# EAGLE design Nick Lester Final (EAGLE 9.2.2)
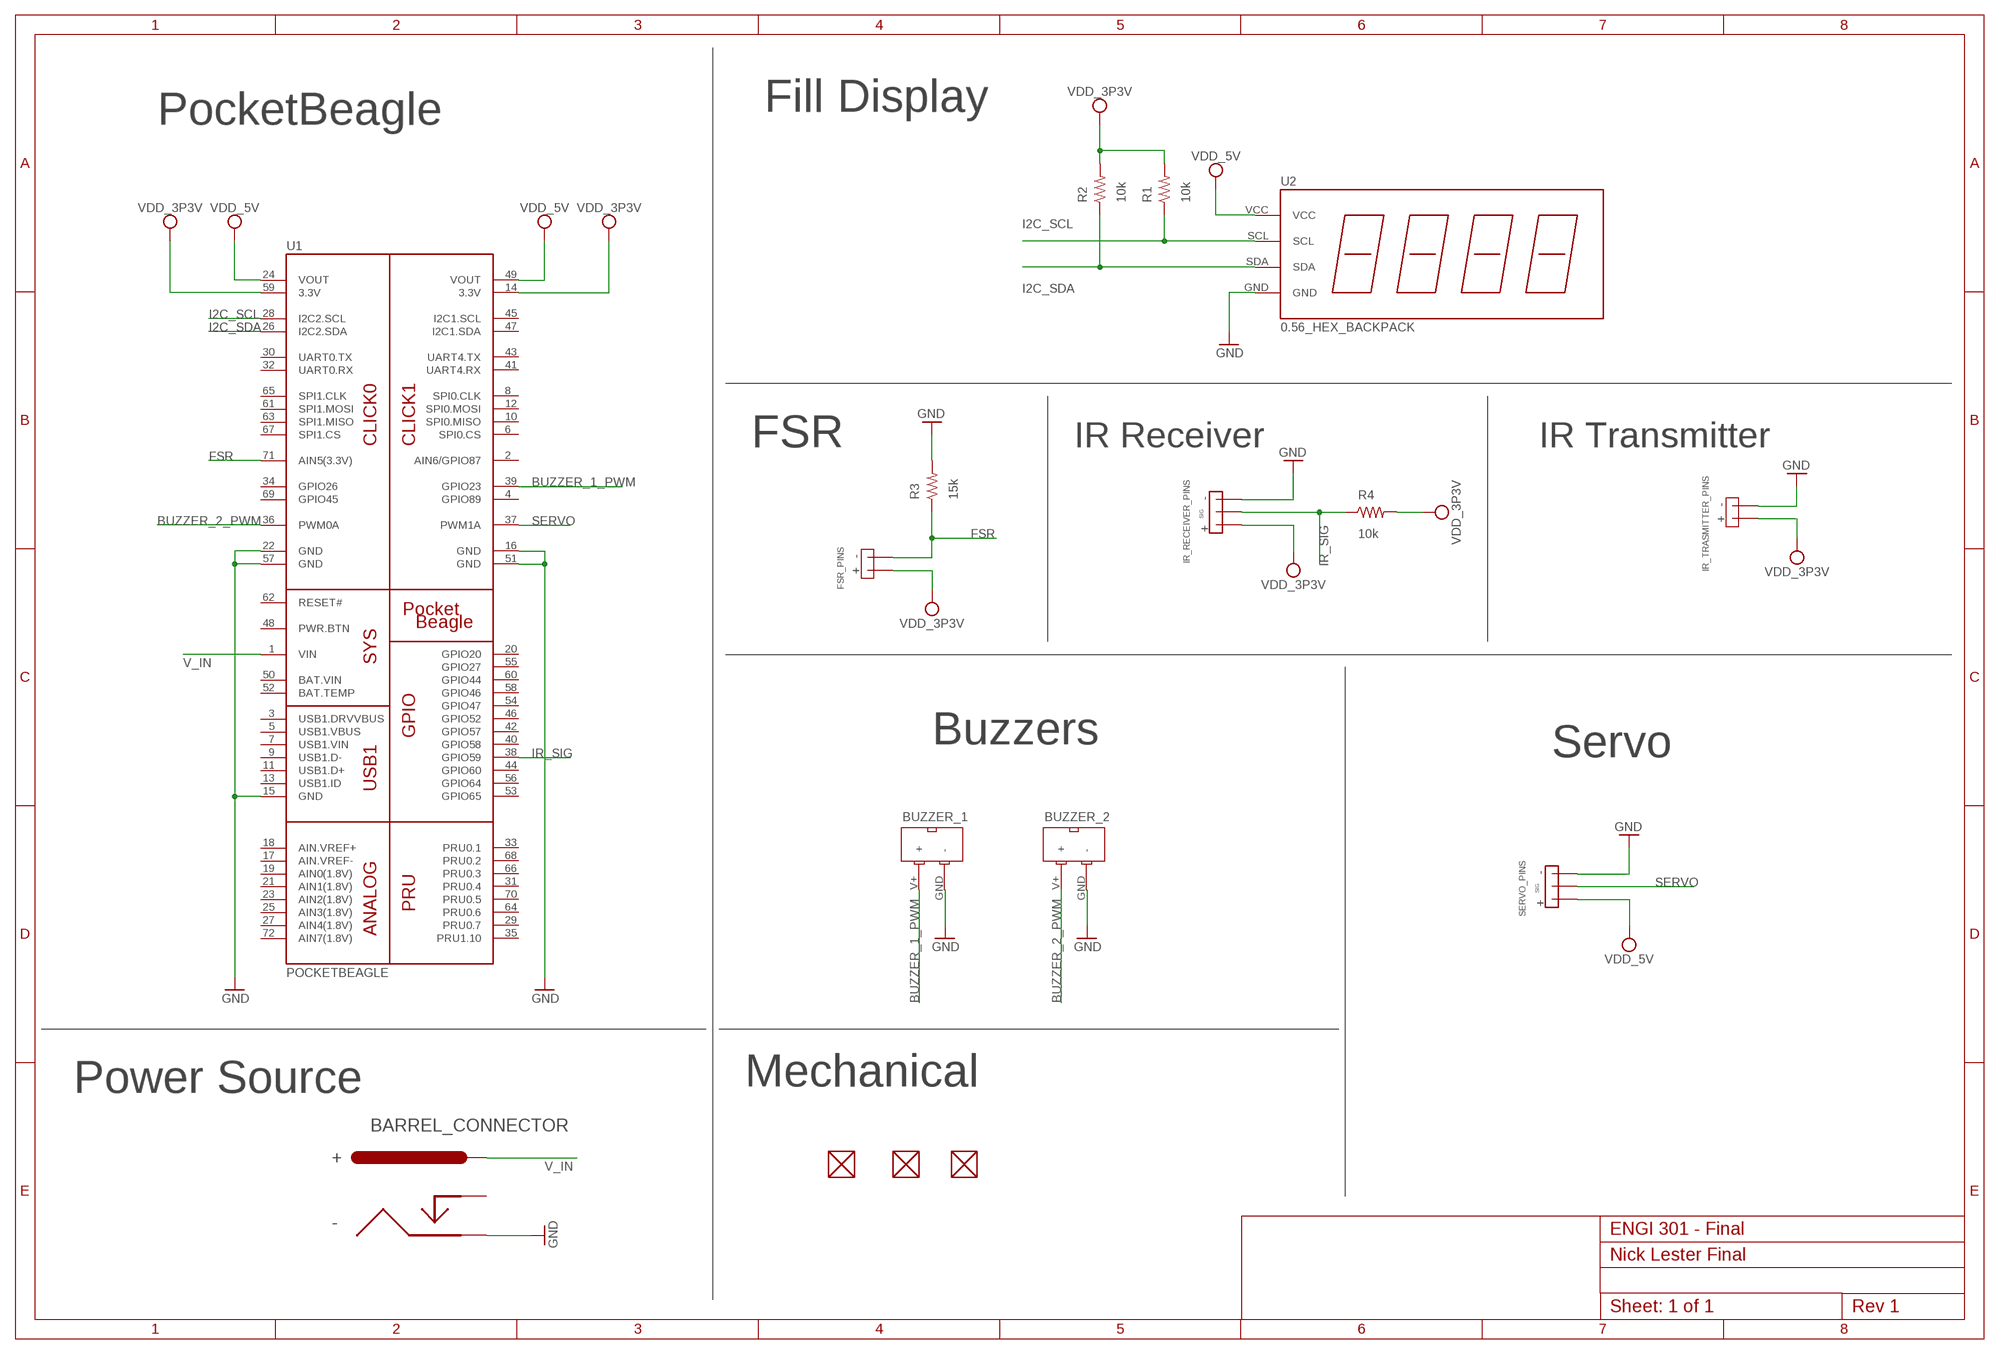
[diagram p0: schematic, sheet 1]

## Parts
BARREL_CONNECTOR  BARREL_CONNECTOR  [BARREL_CONNECTOR]
BUZZER_1  PS1240_BUZZER  [PS1240_BUZZER]
BUZZER_2  PS1240_BUZZER  [PS1240_BUZZER]
FSR_PINS  2_PIN_HEADER  [2_PIN_HEADER]
FUD1  FIDUCIAL  [FIDUCIAL_40MIL]
FUD2  FIDUCIAL  [FIDUCIAL_40MIL]
FUD3  FIDUCIAL  [FIDUCIAL_40MIL]
IR_RECEIVER_PINS  3_PIN_HEADER  [3_PIN_HEADER]
IR_TRASMITTER_PINS  2_PIN_HEADER  [2_PIN_HEADER]
R1  10k  R_R0603  [R0603]
R2  10k  R_R0603  [R0603]
R3  15k  R_R0603  [R0603]
R4  10k  R_R0603  [R0603]
SERVO_PINS  3_PIN_HEADER  [3_PIN_HEADER]
U1  POCKETBEAGLE  [POCKETBEAGLE]
U2  0.56_HEX_BACKPACK  [0.56_HEX_BACKPACK]

## Nets
BUZZER_1_PWM: BUZZER_1.V+(+) U1.39(GPIO23)
BUZZER_2_PWM: BUZZER_2.V+(+) U1.36(PWM0A)
FSR: FSR_PINS.GND R3.1 U1.71(AIN5(3.3V))
GND: BARREL_CONNECTOR.GND BUZZER_1.GND(-) BUZZER_2.GND(-) IR_RECEIVER_PINS.GND IR_TRASMITTER_PINS.GND R3.2 SERVO_PINS.GND U1.15(GND) U1.16(GND) U1.22(GND) U1.51(GND) U1.57(GND) U2.GND
I2C_SCL: R1.1 U1.28(I2C2.SCL) U2.SCL
I2C_SDA: R2.1 U1.26(I2C2.SDA) U2.SDA
IR_SIG: IR_RECEIVER_PINS.SIG R4.1 U1.38(GPIO59)
SERVO: SERVO_PINS.SIG U1.37(PWM1A)
V_IN: BARREL_CONNECTOR.V+ U1.1(VIN)
VDD_3P3V: FSR_PINS.V+ IR_RECEIVER_PINS.V+ IR_TRASMITTER_PINS.V+ R1.2 R2.2 R4.2 U1.14(3.3V) U1.59(3.3V)
VDD_5V: SERVO_PINS.V+ U1.24(VOUT) U1.49(VOUT) U2.VCC
Unconnected: BARREL_CONNECTOR.NC FUD1.P$1 FUD2.P$1 FUD3.P$1 U1.2(AIN6/GPIO87) U1.3(USB1.DRVVBUS) U1.4(GPIO89) U1.5(USB1.VBUS) U1.6(SPI0.CS) U1.7(USB1.VIN) U1.8(SPI0.CLK) U1.9(USB1.D-) U1.10(SPI0.MISO) U1.11(USB1.D+) U1.12(SPI0.MOSI) U1.13(USB1.ID) U1.17(AIN.VREF-) U1.18(AIN.VREF+) U1.19(AIN0(1.8V)) U1.20(GPIO20) U1.21(AIN1(1.8V)) U1.23(AIN2(1.8V)) U1.25(AIN3(1.8V)) U1.27(AIN4(1.8V)) U1.29(PRU0.7) U1.30(UART0.TX) U1.31(PRU0.4) U1.32(UART0.RX) U1.33(PRU0.1) U1.34(GPIO26) U1.35(PRU1.10) U1.40(GPIO58) U1.41(UART4.RX) U1.42(GPIO57) U1.43(UART4.TX) U1.44(GPIO60) U1.45(I2C1.SCL) U1.46(GPIO52) U1.47(I2C1.SDA) U1.48(PWR.BTN) U1.52(BAT.TEMP) U1.53(GPIO65) U1.54(GPIO47) U1.55(GPIO27) U1.56(GPIO64) U1.58(GPIO46) U1.60(GPIO44) U1.61(SPI1.MOSI) U1.62(RESET#) U1.63(SPI1.MISO) U1.64(PRU0.6) U1.65(SPI1.CLK) U1.66(PRU0.3) U1.67(SPI1.CS) U1.68(PRU0.2) U1.69(GPIO45) U1.70(PRU0.5) U1.72(AIN7(1.8V))

## Notes on the sheet
- PocketBeagle | Fill Display
- FSR | IR Receiver | IR Transmitter
- Buzzers | Servo
- Power Source | Mechanical
- ENGI 301 - Final
- 1 of 1

## Power pins joined to a net without a drawn wire
BAT.VIN: U1.50(BAT.VIN)

## Library data of the parts
BARREL_CONNECTOR = Nick Lester Final:BARREL_CONNECTOR: Barrel Connector: https://www.adafruit.com/product/373
BUZZER_1 BUZZER_2 = Nick Lester Final:PS1240_BUZZER: PS1240 Buzzer: https://www.adafruit.com/product/160?gclid=Cj0KCQiAi57gBRDqARIsABhDSMod10IM6KqyKNG4e1XYbRL67-mP7OMwaXZ0MBZD_4btt3ozxb4l5BUaAtnaEALw_wcB
FSR_PINS IR_TRASMITTER_PINS = Nick Lester Final:2_PIN_HEADER: 2 Pin Header: https://media.digikey.com/pdf/Data%20Sheets/Sullins%20PDFs/Female_Headers.100_DS.pdf
FUD1-FUD3 = ENGI301:FIDUCIAL
IR_RECEIVER_PINS SERVO_PINS = Nick Lester Final:3_PIN_HEADER: 3 Pin Header: https://media.digikey.com/pdf/Data%20Sheets/Sullins%20PDFs/Female_Headers.100_DS.pdf
R1-R4 = ENGI301:R_: RESISTOR, American symbol
U1 = ENGI301:POCKETBEAGLE
U2 = ENGI301:0.56_HEX_BACKPACK: 0.56" LED HEX Backback - Adafruit HT16K33 - https://www.adafruit.com/product/878 - https://www.adafruit.com/product/879 - https://www.adafruit.com/product/880 - https://www.adafruit.com/product/881 - https://www.adafruit.com/product/1002

## Board
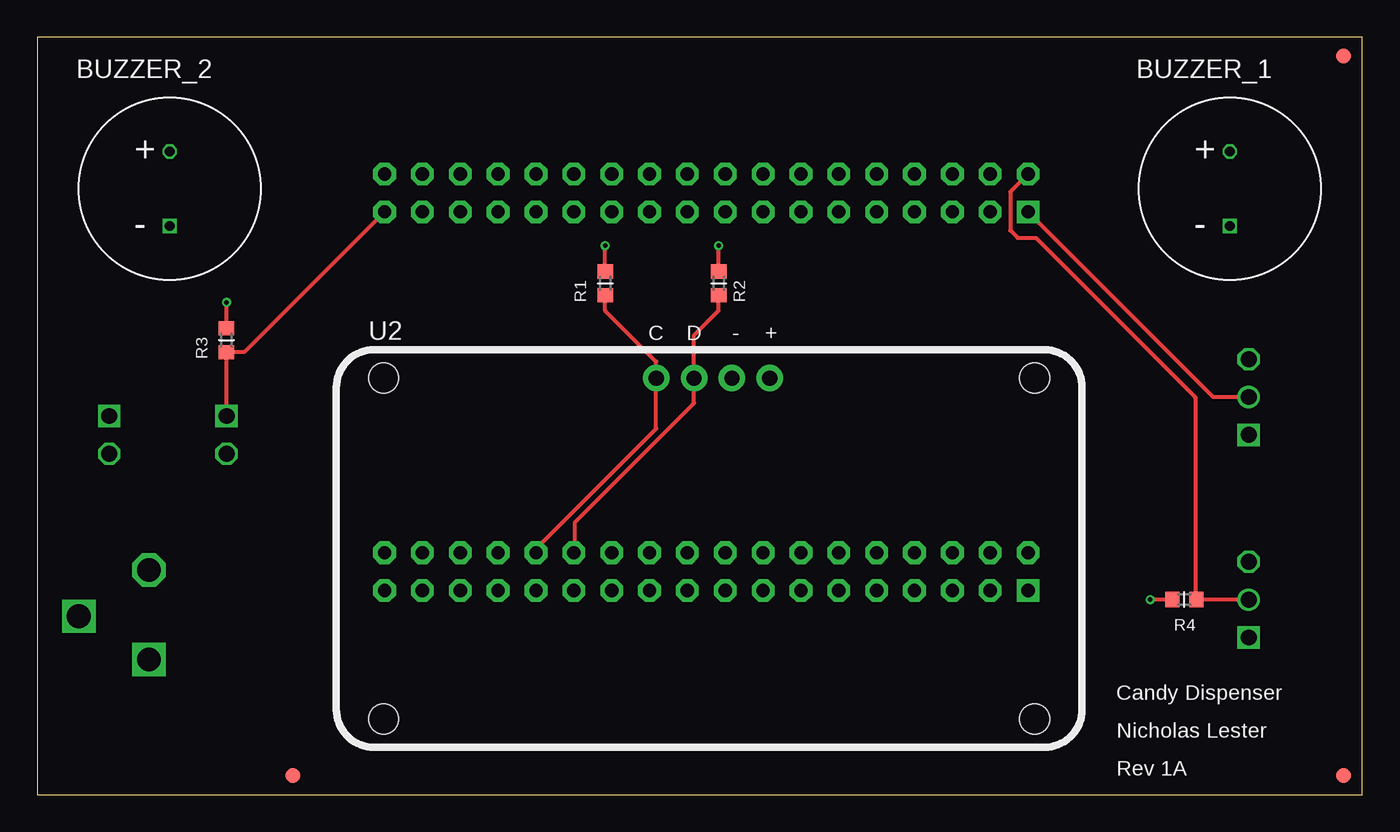
[diagram p1: board, top side]
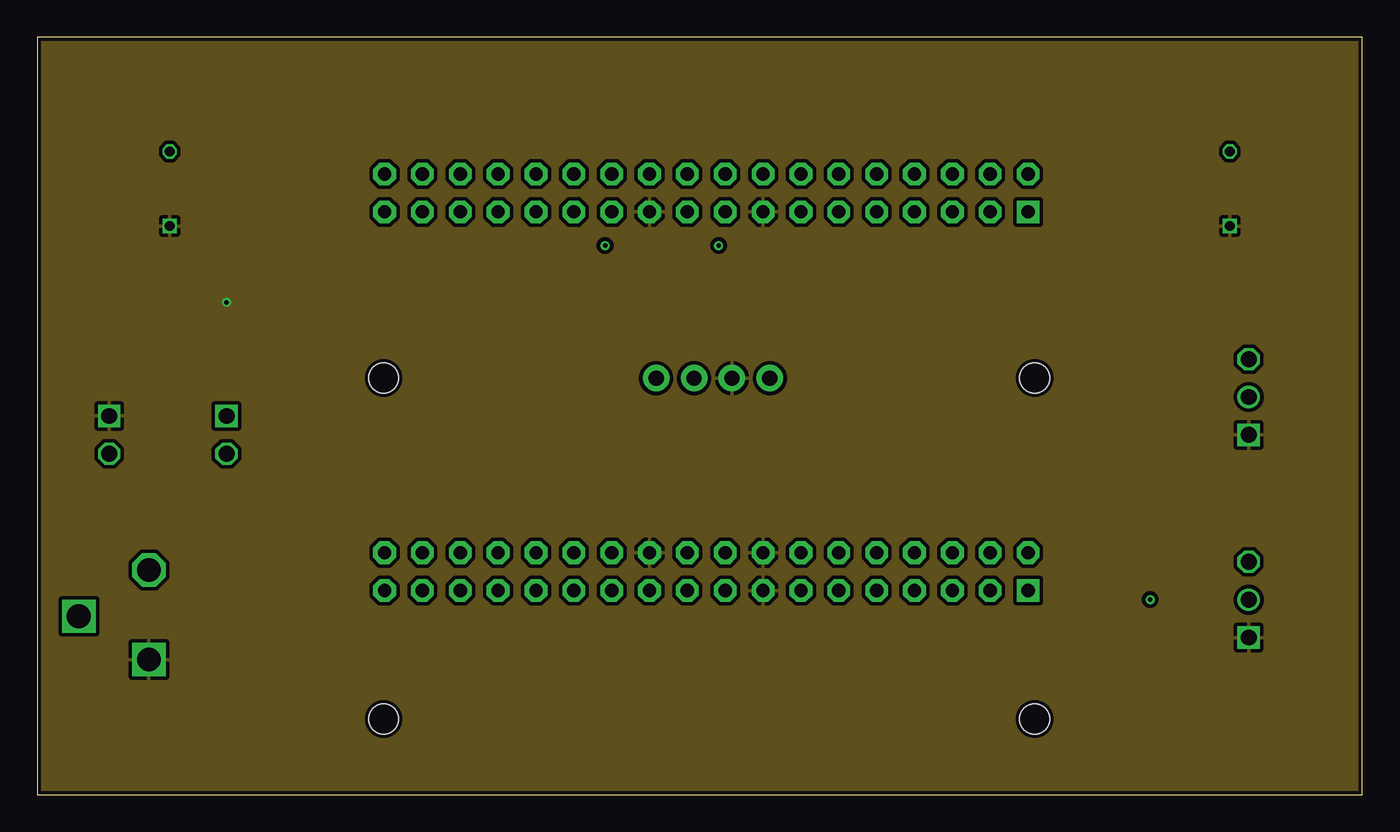
[diagram p2: board, inner layer Route2]
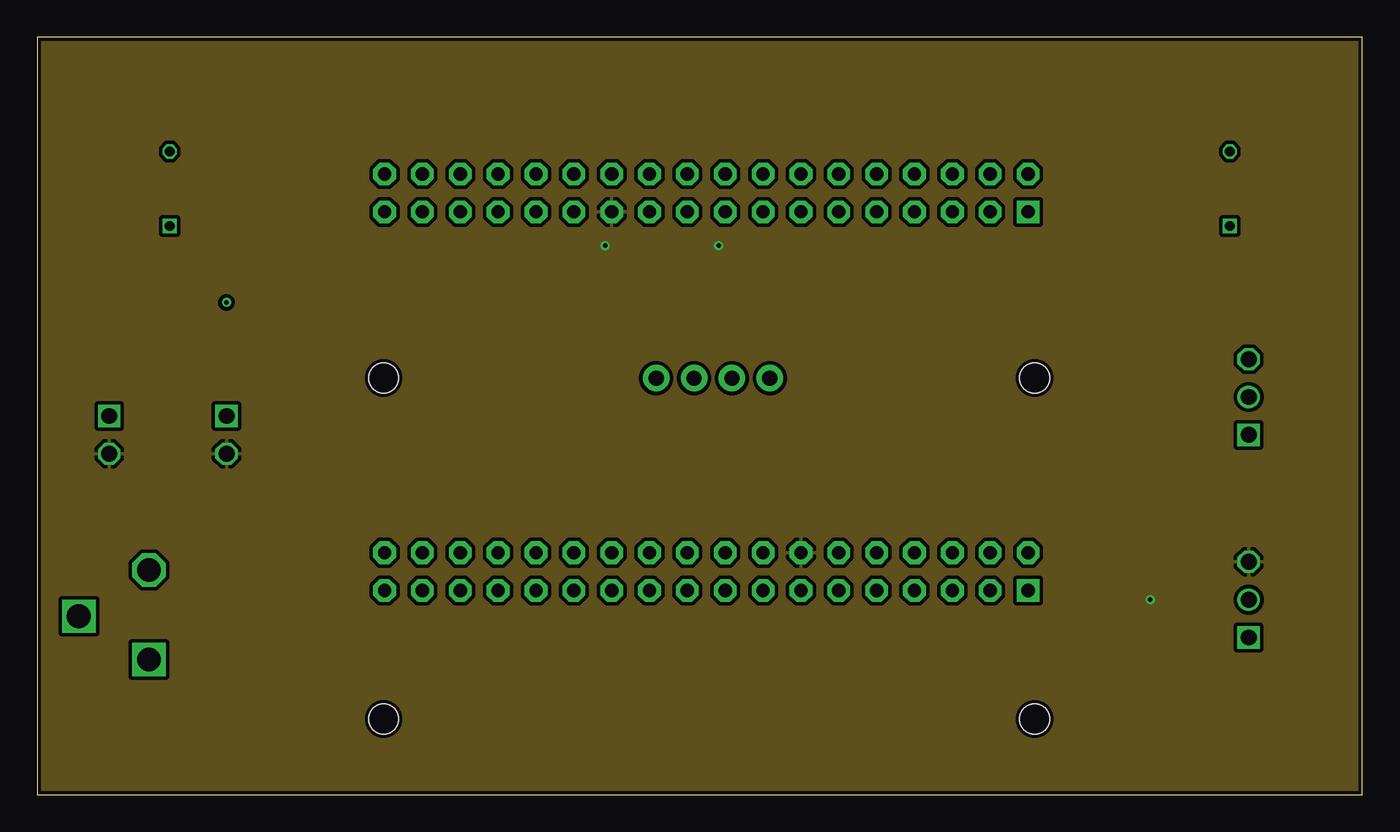
[diagram p3: board, inner layer Route15]
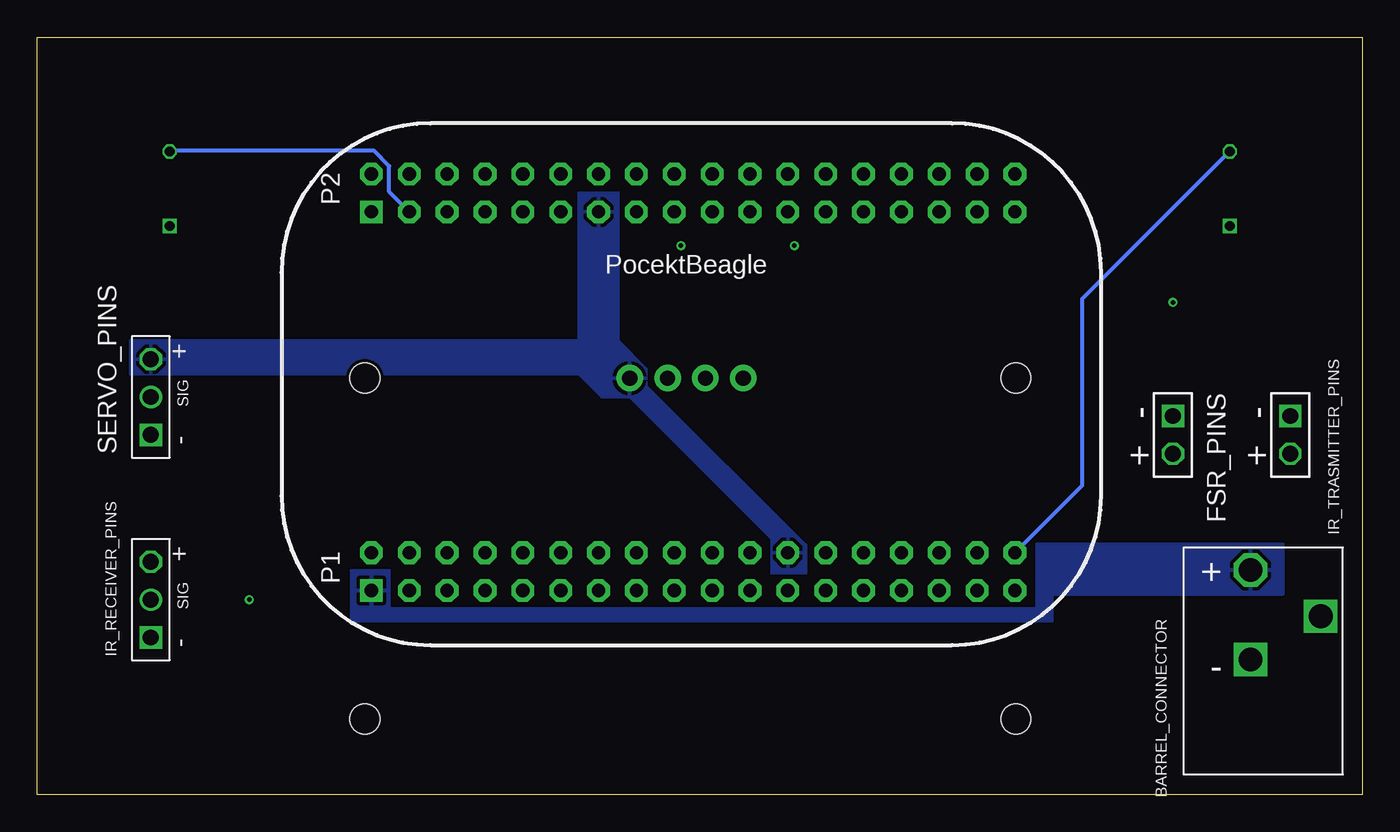
[diagram p4: board, bottom side, seen from below]

Size 88.9 x 50.8 mm. Coordinates in mm from the lower left corner, seen from the top.
Outline: 0,0 88.9,0 88.9,50.8 0,50.8 0,0
Copper layers (1*2*15*16): Top 0.035mm / dielectric 0.23mm / Route2 0.035mm / dielectric 0.93mm / Route15 0.035mm / dielectric 0.23mm / Bottom 0.035mm
Design rules "ENGI301_4lyr": minimum track width 10mil, minimum drill 12mil, track to track 10mil, track to pad 10mil, pad to pad 10mil, via to via 10mil, smd to smd 10mil, copper to edge 10mil, drill to drill 12mil, minimum pad ring 6mil, minimum via ring 6mil, stop-mask expansion 3mil, vias tented up to drill 25mil, thermal gap 10mil

### Footprints (pad centres in the part's own frame; a part is rotated, then mirrored left to right if it is on the bottom)
BARREL_CONNECTOR = drill 1.6 square: GND 0,3; NC -4.7,0.1 | drill 1.6 octagon: V+ 0,-3
PS1240_BUZZER = drill 0.65 square: GND 0,-2.5 | drill 0.65 octagon: V+ 0,2.5
2_PIN_HEADER = drill 1.067 square: GND -1.27,0 | drill 1.067 octagon: V+ 1.27,0
FIDUCIAL_40MIL = smd 1.016 x 1.016: P$1 0,0
3_PIN_HEADER = drill 1.067 square: GND -2.54,0 | drill 1.067: SIG 0,0 | drill 1.067 octagon: V+ 2.54,0
R0603 = smd 0.95 x 1.031: 1 -0.8,0; 2 0.8,0
POCKETBEAGLE = drill 0.889 pad 1.524 square: 1 5.91,3.53; 37 5.91,28.93 | drill 0.889 pad 1.524 octagon: 2 5.91,6.07; 3 8.45,3.53; 4 8.45,6.07; 5 10.99,3.53; 6 10.99,6.07; 7 13.53,3.53; 8 13.53,6.07; 9 16.07,3.53; 10 16.07,6.07; 11 18.61,3.53; 12 18.61,6.07; 13 21.15,3.53; 14 21.15,6.07; 15 23.69,3.53; 16 23.69,6.07; 17 26.23,3.53; 18 26.23,6.07; 19 28.77,3.53; 20 28.77,6.07; 21 31.31,3.53; 22 31.31,6.07; 23 33.85,3.53; 24 33.85,6.07; 25 36.39,3.53; 26 36.39,6.07; 27 38.93,3.53; 28 38.93,6.07; 29 41.47,3.53; 30 41.47,6.07; 31 44.01,3.53; 32 44.01,6.07; 33 46.55,3.53; 34 46.55,6.07; 35 49.09,3.53; 36 49.09,6.07; 38 5.91,31.47; 39 8.45,28.93; 40 8.45,31.47; 41 10.99,28.93; 42 10.99,31.47; 43 13.53,28.93; 44 13.53,31.47; 45 16.07,28.93; 46 16.07,31.47; 47 18.61,28.93; 48 18.61,31.47; 49 21.15,28.93; 50 21.15,31.47; 51 23.69,28.93; 52 23.69,31.47; 53 26.23,28.93; 54 26.23,31.47; 55 28.77,28.93; 56 28.77,31.47; 57 31.31,28.93; 58 31.31,31.47; 59 33.85,28.93; 60 33.85,31.47; 61 36.39,28.93; 62 36.39,31.47; 63 38.93,28.93; 64 38.93,31.47; 65 41.47,28.93; 66 41.47,31.47; 67 44.01,28.93; 68 44.01,31.47; 69 46.55,28.93; 70 46.55,31.47; 71 49.09,28.93; 72 49.09,31.47
0.56_HEX_BACKPACK = drill 1.016 pad 1.778: GND 1.524,11.43; SCL -3.556,11.43; SDA -1.016,11.43; VCC 4.064,11.43 | hole 2: -21.844,-11.43; 21.844,-11.43; -21.844,11.43; 21.844,11.43

### Placement (x,y rotation side)
BARREL_CONNECTOR  7.49,12.06 180 bottom
BUZZER_1  80.01,40.64 0 top
BUZZER_2  8.89,40.64 0 top
FSR_PINS  12.7,24.13 270 bottom
FUD1  87.63,49.53 0 top
FUD2  17.14,1.27 0 top
FUD3  87.63,1.27 0 top
IR_RECEIVER_PINS  81.28,13.08 90 bottom
IR_TRASMITTER_PINS  4.83,24.13 270 bottom
R1  38.1,34.29 90 top
R2  45.72,34.29 90 top
R3  12.7,30.48 90 top
R4  76.96,13.08 180 top
SERVO_PINS  81.28,26.67 90 bottom
U1  72.39,10.16 0 bottom
U2  45.09,16.51 0 top

### Tracks (layer width: path | path; a pad name or v marks a point on that pad's centre or on a via)
BUZZER_1_PWM
  Bottom 0.254: U1.39 65.28,40.43 65.28,42.16 66.29,43.18 79.97,43.18 BUZZER_1.V+
BUZZER_2_PWM
  Bottom 0.254: BUZZER_2.V+ 18.8,33.23 18.8,20.73 U1.36
FSR
  Top 0.254: U1.71 13.93,29.72 12.74,29.72 R3.1 FSR_PINS.GND
GND  (via drill 0.3 pad 0.61)
  Top 0.254: R3.2 v12.7,33.02
  pour Route2: -1.27,-1.27 90.17,-1.27 90.17,52.07 -1.27,52.07
I2C_SCL
  Top 0.254: U1.28 33.46,16.48 41.53,24.55 U2.SCL 41.53,29.05 38.1,32.47 R1.1
I2C_SDA
  Top 0.254: U1.26 36.07,16.3 36.07,18.26 44.07,26.26 U2.SDA 44.07,30.82 45.72,32.47 R2.1
IR_SIG
  Top 0.254: U1.38 65.28,40.43 65.28,37.85 65.79,37.34 67.01,37.34 77.7,26.64 77.7,13.14 R4.1 IR_RECEIVER_PINS.SIG
SERVO
  Top 0.254: U1.37 78.9,26.67 SERVO_PINS.SIG
V_IN
  pour Bottom: 5.33,13.46 5.33,16.76 21.84,16.76 21.84,12.45 65.28,12.45 65.28,14.99 67.82,14.99 67.82,11.68 20.83,11.68 20.83,13.46
VDD_3P3V  (via drill 0.3 pad 0.61)
  Top 0.254: R1.2 v38.1,36.83 | R2.2 v45.72,36.83 | R4.2 v74.68,13.08
  pour Route15: -2.54,-2.54 91.44,-2.54 91.44,53.34 -2.54,53.34
VDD_5V
  pour Bottom: 49.91,40.39 49.91,30.48 48.01,28.57 48.01,27.43 37.34,16.76 37.34,14.86 39.62,14.86 39.62,17.14 49.15,26.67 51.05,26.67 52.58,28.19 82.68,28.19 82.68,30.48 52.58,30.48 52.58,40.39

### Text on the board
tPlace: Candy Dispenser | Nicholas Lester | Rev 1A